# EAGLE design roller_sensor (EAGLE 4.16)
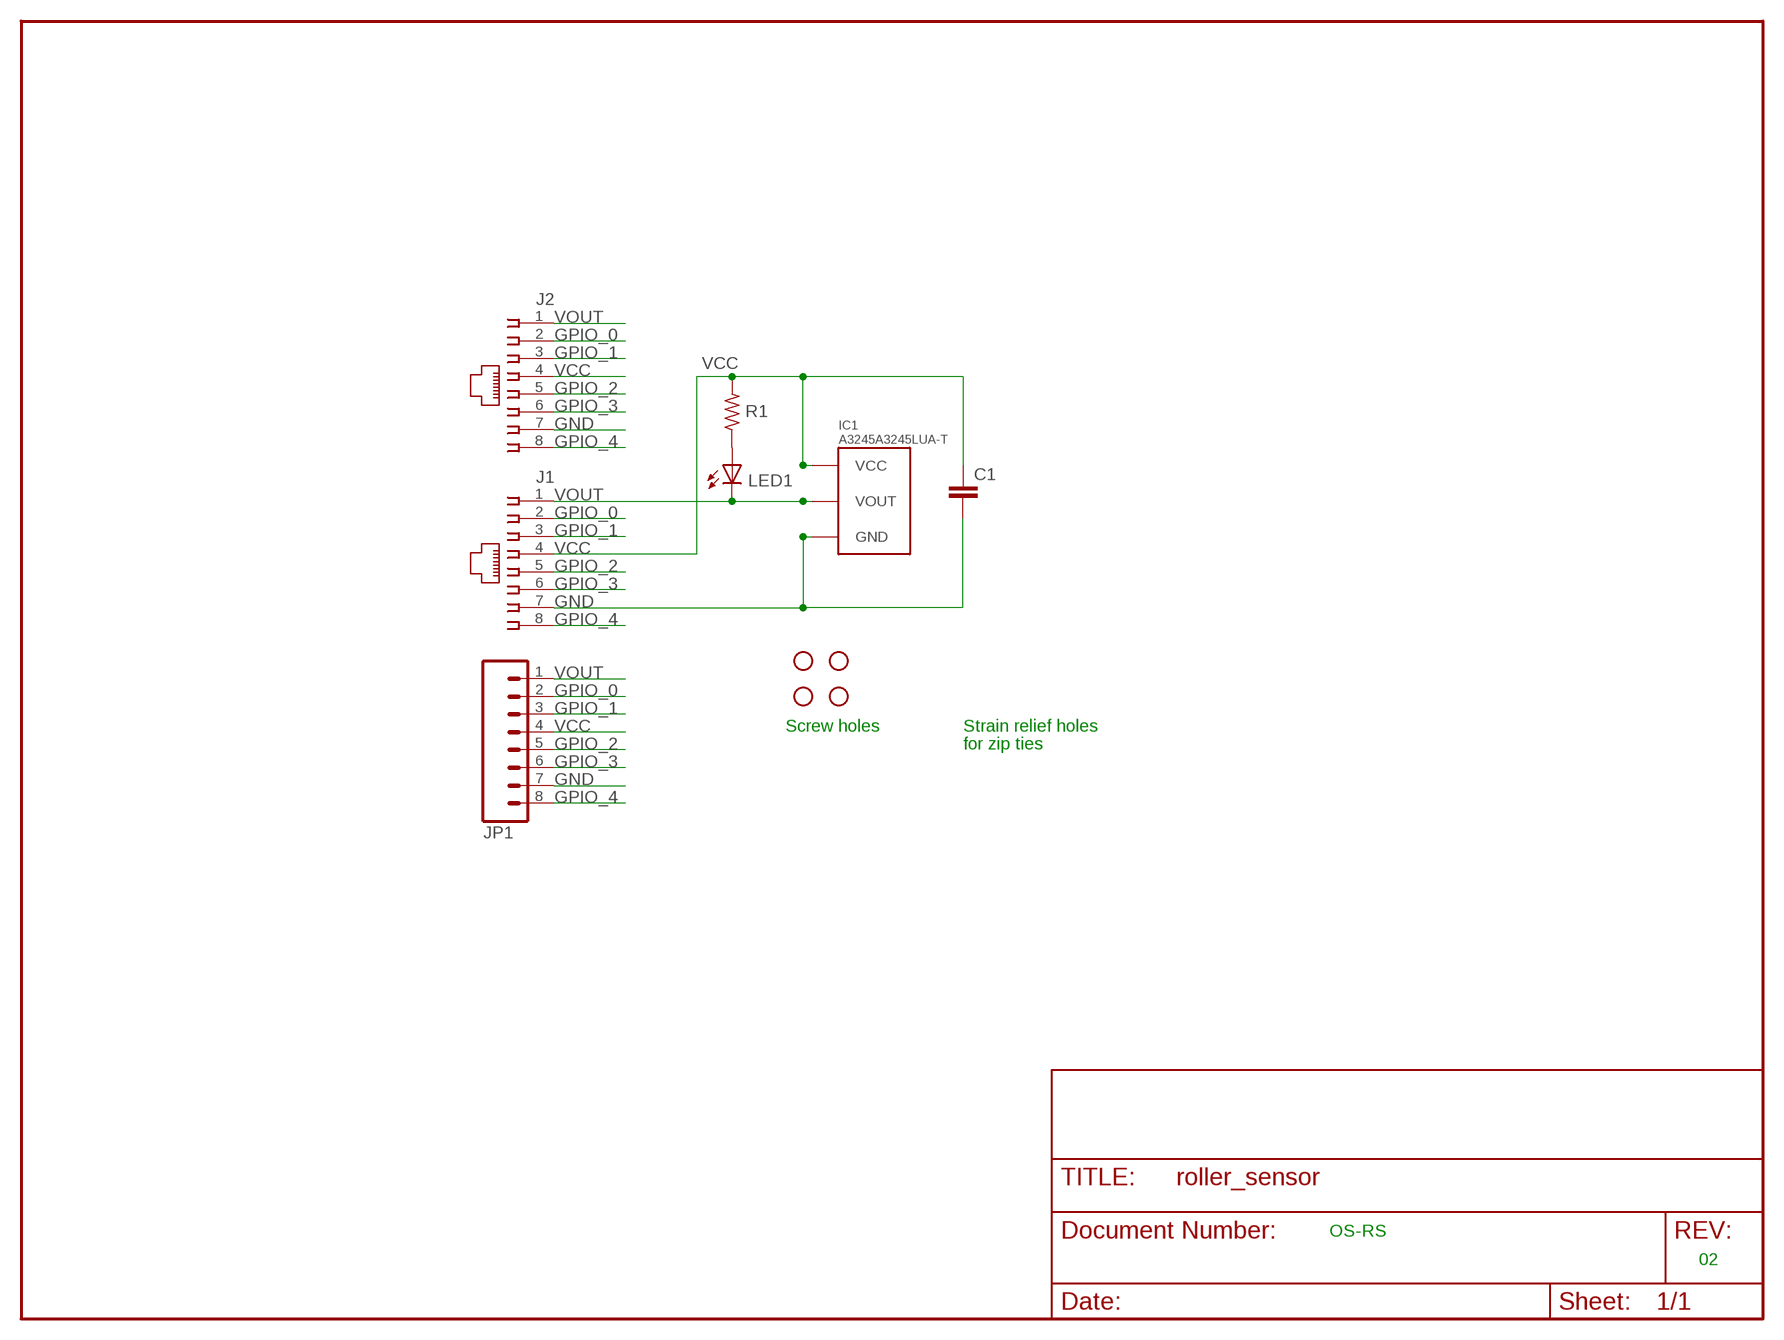
[diagram p0: schematic, sheet 1]

## Parts
C1  C-EU025-025X050  [C025-025X050]
IC1  A3245A3245LUA-T  [A3245]
J1  555164-1  [555164-1]
J2  555164-1  [555164-1]
JP1  M08  [1X08]
LED1  LED5MM  [LED5MM]
R1  R-US_0309/V  [0309V]
U$1  STAND-OFF  [STAND-OFF]
U$2  STAND-OFF  [STAND-OFF]
U$3  STAND-OFF  [STAND-OFF]
U$4  STAND-OFF  [STAND-OFF]

## Nets
GND: C1.2 IC1.GND J1.7 J2.7 JP1.7
GPIO_0: J1.2 J2.2 JP1.2
GPIO_1: J1.3 J2.3 JP1.3
GPIO_2: J1.5 J2.5 JP1.5
GPIO_3: J1.6 J2.6 JP1.6
GPIO_4: J1.8 J2.8 JP1.8
N$2: LED1.A R1.1
VCC: C1.1 IC1.VCC J1.4 J2.4 JP1.4 R1.2
VOUT: IC1.VOUT J1.1 J2.1 JP1.1 LED1.K(C)

## Notes on the sheet
- Screw holes | Strain relief holes
- for zip ties
- OS-RS
- 02

## Library data of the parts
C1 = rcl:C-EU: CAPACITOR, European symbol
IC1 = roller_sensor:A3245
J1 J2 = roller_sensor:555164-1: AMP connector
JP1 = SparkFun:M08: Header 8 Standard 8-pin 0.1" header. Use with straight break away headers (SKU : PRT-00116), right angle break away headers (PRT-00553), swiss pins (PRT-00743), machine pins (PRT-00117), and female headers (PRT-00115).
LED1 = led:LED: LED OSRAM: - CHIPLED LG R971, LG N971, LY N971, LG Q971, LY Q971, LO R971, LY R971 LH N974, LH R974 LS Q976, LO Q976, LY Q976 LO Q996 - Hyper CHIPLED LW Q18S LB Q993, LB Q99A, LB R99A - SideLED LS A670, LO A670, LY A670, LG A670, LP A670 LB A673, LV A673, LT A673, LW A673 LH A674 LY A675 LS A676, LA A676, LO A676, LY A676, LW A676 LS A679, LY A679, LG A679 - Hyper Micro SIDELED® LS Y876, LA Y876, LO Y876, LY Y876 LT Y87S - SmartLED LW L88C, LW L88S LB L89C, LB L89S, LG L890 LS L89K, LO L89K, LY L89K LS L896, LA L896, LO L896, LY L896 - TOPLED LS T670, LO T670, LY T670, LG T670, LP T670 LSG T670, LSP T670, LSY T670, LOP T670, LYG T670 LG T671, LOG T671, LSG T671 LB T673, LV T673, LT T673, LW T673 LH T674 LS T676, LA T676, LO T676, LY T676, LB T676, LH T676, LSB T676, LW T676 LB T67C, LV T67C, LT T67C, LS T67K, LO T67K, LY T67K, LW E67C LS E67B, LA E67B, LO E67B, LY E67B, LB E67C, LV E67C, LT E67C LW T67C LS T679, LY T679, LG T679 LS T770, LO T770, LY T770, LG T770, LP T770 LB T773, LV T773, LT T773, LW T773 LH T774 LS E675, LA E675, LY E675, LS T675 LS T776, LA T776, LO T776, LY T776, LB T776 LHGB T686 LT T68C, LB T68C - Hyper Mini TOPLED® LB M676 - Mini TOPLED Santana® LG M470 LS M47K, LO M47K, LY M47K Source: http://www.osram.convergy.de - LUMILED® LXK2-PW12-R00, LXK2-PW12-S00, LXK2-PW14-U00, LXK2-PW14-V00 LXK2-PM12-R00, LXK2-PM12-S00, LXK2-PM14-U00 LXK2-PE12-Q00, LXK2-PE12-R00, LXK2-PE12-S00, LXK2-PE14-T00, LXK2-PE14-U00 LXK2-PB12-K00, LXK2-PB12-L00, LXK2-PB12-M00, LXK2-PB14-N00, LXK2-PB14-P00, LXK2-PB14-Q00 LXK2-PR12-L00, LXK2-PR12-M00, LXK2-PR14-Q00, LXK2-PR14-R00 LXK2-PD12-Q00, LXK2-PD12-R00, LXK2-PD12-S00 LXK2-PH12-R00, LXK2-PH12-S00 LXK2-PL12-P00, LXK2-PL12-Q00, LXK2-PL12-R00 Source: www.luxeon.com
R1 = rcl:R-US_: RESISTOR, American symbol
U$1-U$4 = SparkFun:STAND-OFF: Stand Off This is the mechanical footprint for a #4 phillips button head screw. Use the keepout ring to avoid running the screw head into surrounding components. SKU : PRT-00447

## Board
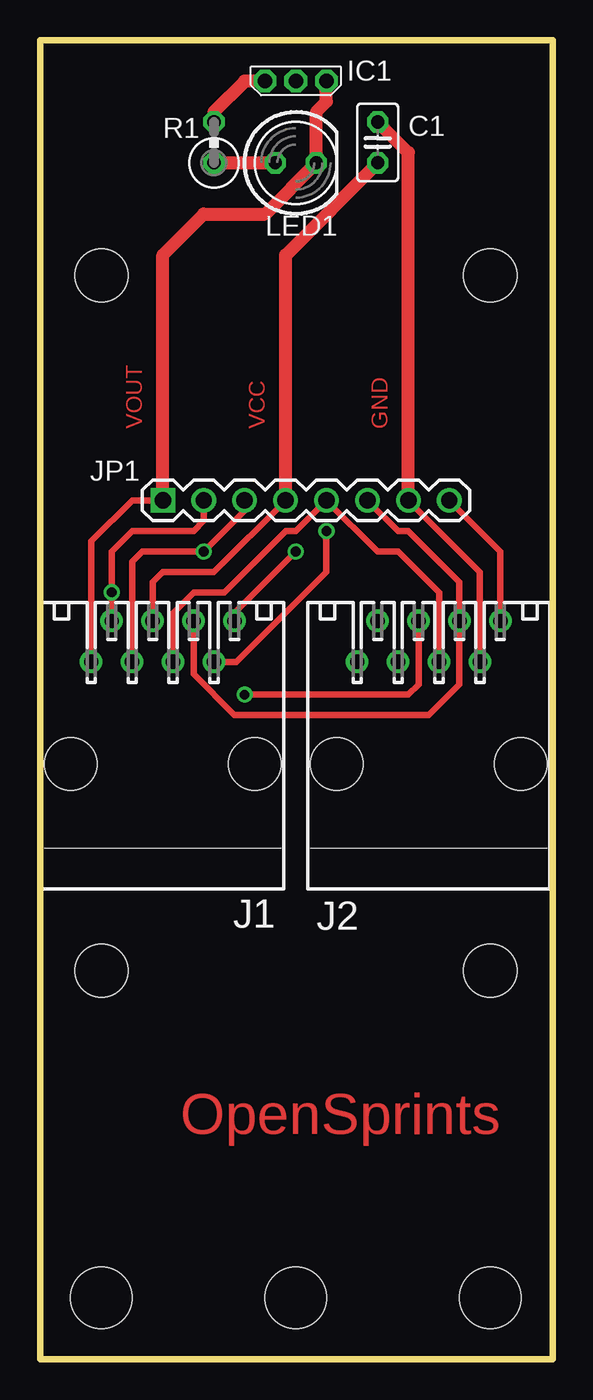
[diagram p1: board, top side]
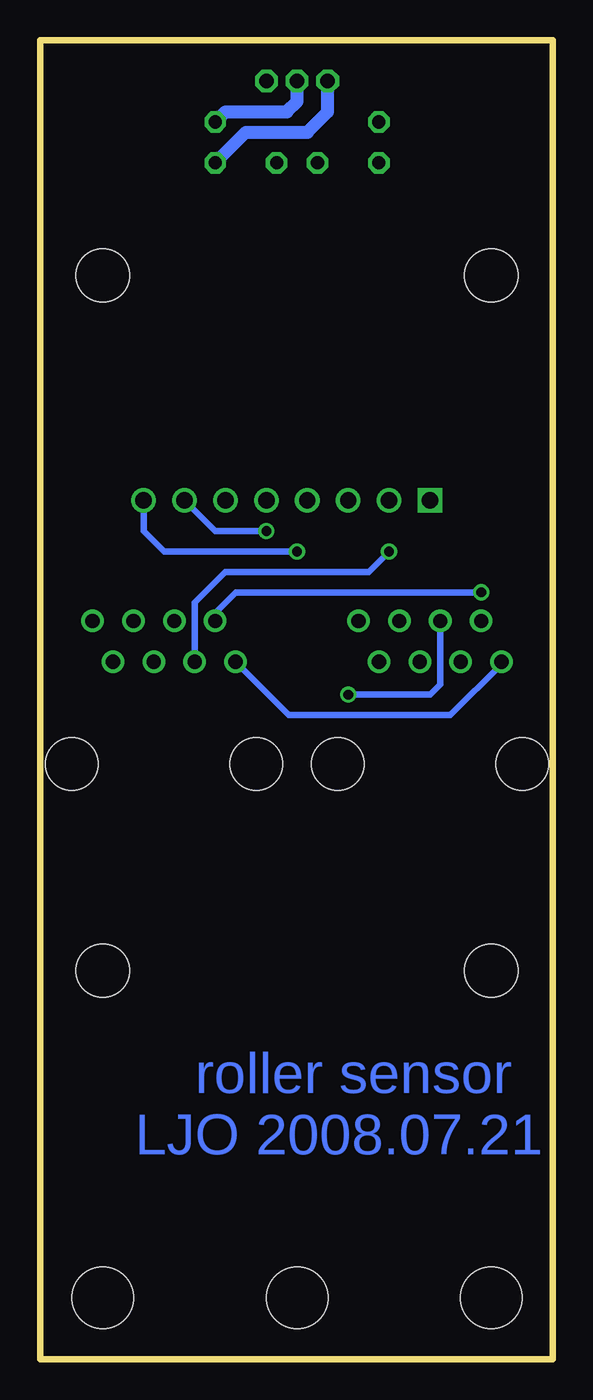
[diagram p2: board, bottom side, seen from below]

Size 31.8 x 81.91 mm. Coordinates in mm from the lower left corner, seen from the top.
Outline: 0,0 31.8,0 31.8,81.91 0,81.91 0,0
Copper layers (1*16): Top 0.035mm / dielectric 1.5mm / Bottom 0.035mm
Design rules "advanced_circuits_Luke": minimum track width 8mil, minimum drill 8mil, track to track 8mil, track to pad 8mil, pad to pad 8mil, via to via 8mil, smd to smd 8mil, copper to edge 40mil, drill to drill 8mil, minimum pad ring 10mil, minimum via ring 8mil, stop-mask expansion 4mil, vias tented up to drill 0mil, thermal gap 10mil
Holes 3.81 mm at 3.8,3.81 15.86,3.81 27.93,3.81

### Footprints (pad centres in the part's own frame; a part is rotated, then mirrored left to right if it is on the bottom)
C025-025X050 = drill 0.813 octagon: 1 -1.27,0; 2 1.27,0
A3245 = drill 0.9 pad 1.016 octagon: GND 0,0; VCC 0,-1.905; VOUT 0,1.905
555164-1 = drill 0.889 round: 1 -4.445,5.207; 2 -3.175,7.747; 3 -1.905,5.207; 4 -0.635,7.747; 5 0.635,5.207; 6 1.905,7.747; 7 3.175,5.207; 8 4.445,7.747 | hole 3.251: -5.715,-1.143; 5.715,-1.143
1X08 = drill 1.016 square: 1 0,0 | drill 1.016 round: 2 2.54,0; 3 5.08,0; 4 7.62,0; 5 10.16,0; 6 12.7,0; 7 15.24,0; 8 17.78,0
LED5MM = drill 0.813 octagon: A -1.27,0; K 1.27,0
0309V = drill 0.813 octagon: 1 -1.27,0; 2 1.27,0
STAND-OFF = hole 3.302: 0,0

### Placement (x,y rotation side)
C1  20.94,75.56 90 top
IC1  15.86,79.37 270 top
J1  7.61,38.09 0 top
J2  24.12,38.09 0 top
JP1  7.61,53.34 0 top
LED1  15.86,74.29 0 top
R1  10.78,75.56 90 top
U$1  3.8,24.12 0 top
U$2  27.93,24.12 0 top
U$3  3.8,67.31 0 top
U$4  27.93,67.31 0 top

### Tracks (layer width: path | path; a pad name or v marks a point on that pad's centre or on a via)
GND  (via drill 0.6)
  Top 0.406: J1.7 12.18,43.3 17.77,48.89 v17.77,51.43 | J2.7 27.29,48.89 JP1.7
  Top 0.813: JP1.7 22.85,74.93 C1.2
  Bottom 0.406: v17.77,51.43 20.94,51.43 JP1.7
  Bottom 0.813: C1.2 20.31,77.47 16.5,77.47 15.86,78.1 IC1.GND
GPIO_0  (via drill 0.6)
  Top 0.406: J1.2 v4.43,47.62 4.43,50.16 5.7,51.43 9.51,51.43 10.15,52.06 JP1.2
  Bottom 0.406: J2.2 20.94,46.35 19.67,47.62 v4.43,47.62
GPIO_1  (via drill 0.6)
  Top 0.406: J1.3 5.7,49.52 6.34,50.16 v10.15,50.16 12.69,52.7 JP1.3
  Bottom 0.406: J2.3 22.21,46.98 20.31,48.89 11.42,48.89 v10.15,50.16
GPIO_2
  Top 0.406: J1.5 8.24,46.35 9.51,47.62 11.42,47.62 15.23,51.43 15.86,51.43 JP1.5 20.94,50.16 22.21,50.16 24.75,47.62 J2.5
GPIO_3
  Top 0.406: JP1.6 22.21,51.43 22.85,51.43 26.02,48.25 J2.6 26.02,41.9 24.12,40 12.05,40 9.51,42.54 J1.6
GPIO_4  (via drill 0.6)
  Top 0.406: J1.8 12.05,46.35 v15.86,50.16 | J2.8 28.56,50.16 JP1.8
  Bottom 0.406: v15.86,50.16 24.12,50.16 25.39,51.43 JP1.8
N$2
  Top 0.813: R1.1 LED1.A
VCC  (via drill 0.6)
  Top 0.406: J1.4 6.97,48.25 7.61,48.89 10.78,48.89 JP1.4 | J2.4 23.48,41.9 22.85,41.27 v12.69,41.27
  Top 0.813: JP1.4 15.23,68.58 C1.1 | R1.2 10.78,77.47 12.69,79.37 IC1.VCC
  Bottom 0.406: v12.69,41.27 7.61,41.27 6.97,41.9 J1.4
  Bottom 0.813: IC1.VCC 13.96,77.47 15.23,76.2 19.04,76.2 C1.1
VOUT
  Top 0.406: J1.1 3.16,50.79 5.7,53.34 JP1.1
  Top 0.813: JP1.1 7.61,68.58 10.15,71.12 13.96,71.12 LED1.K 17.13,77.47 17.77,78.1 IC1.VOUT
  Bottom 0.406: J2.1 16.37,40 6.34,40 3.16,43.17 J1.1

### Text on the board
Top: VOUT | VCC | GND | OpenSprints
Bottom: roller sensor | LJO 2008.07.21